# Altium schematic sheet 425AK01A_S05.SchDoc
size A3; DocumentNumber: 5; SheetNumber: 5; SheetTotal: 10; PageSetup: Record=PageOptions|CenterHorizontal=True|CenterVertical=True|PrintScale=1.01|XCorrection=1.00|YCorrection=1.00|PrintKind=1|BorderSize=5000000|LeftOffset=0|BottomOffset=0|Orientation=2|PaperLength=1000|PaperWidth=1000|Scale=100|PaperSource=15|PrintQuality=600|MediaType=1|DitherType=10|PaperKind=A3|PrintScaleMode=1; 00_Drawn: RJG; 00_Date: 8APR2022; 00_Checked: SR; 00_Approved: GN; 00_Line1: Clock Buffer Circuits, RSB A
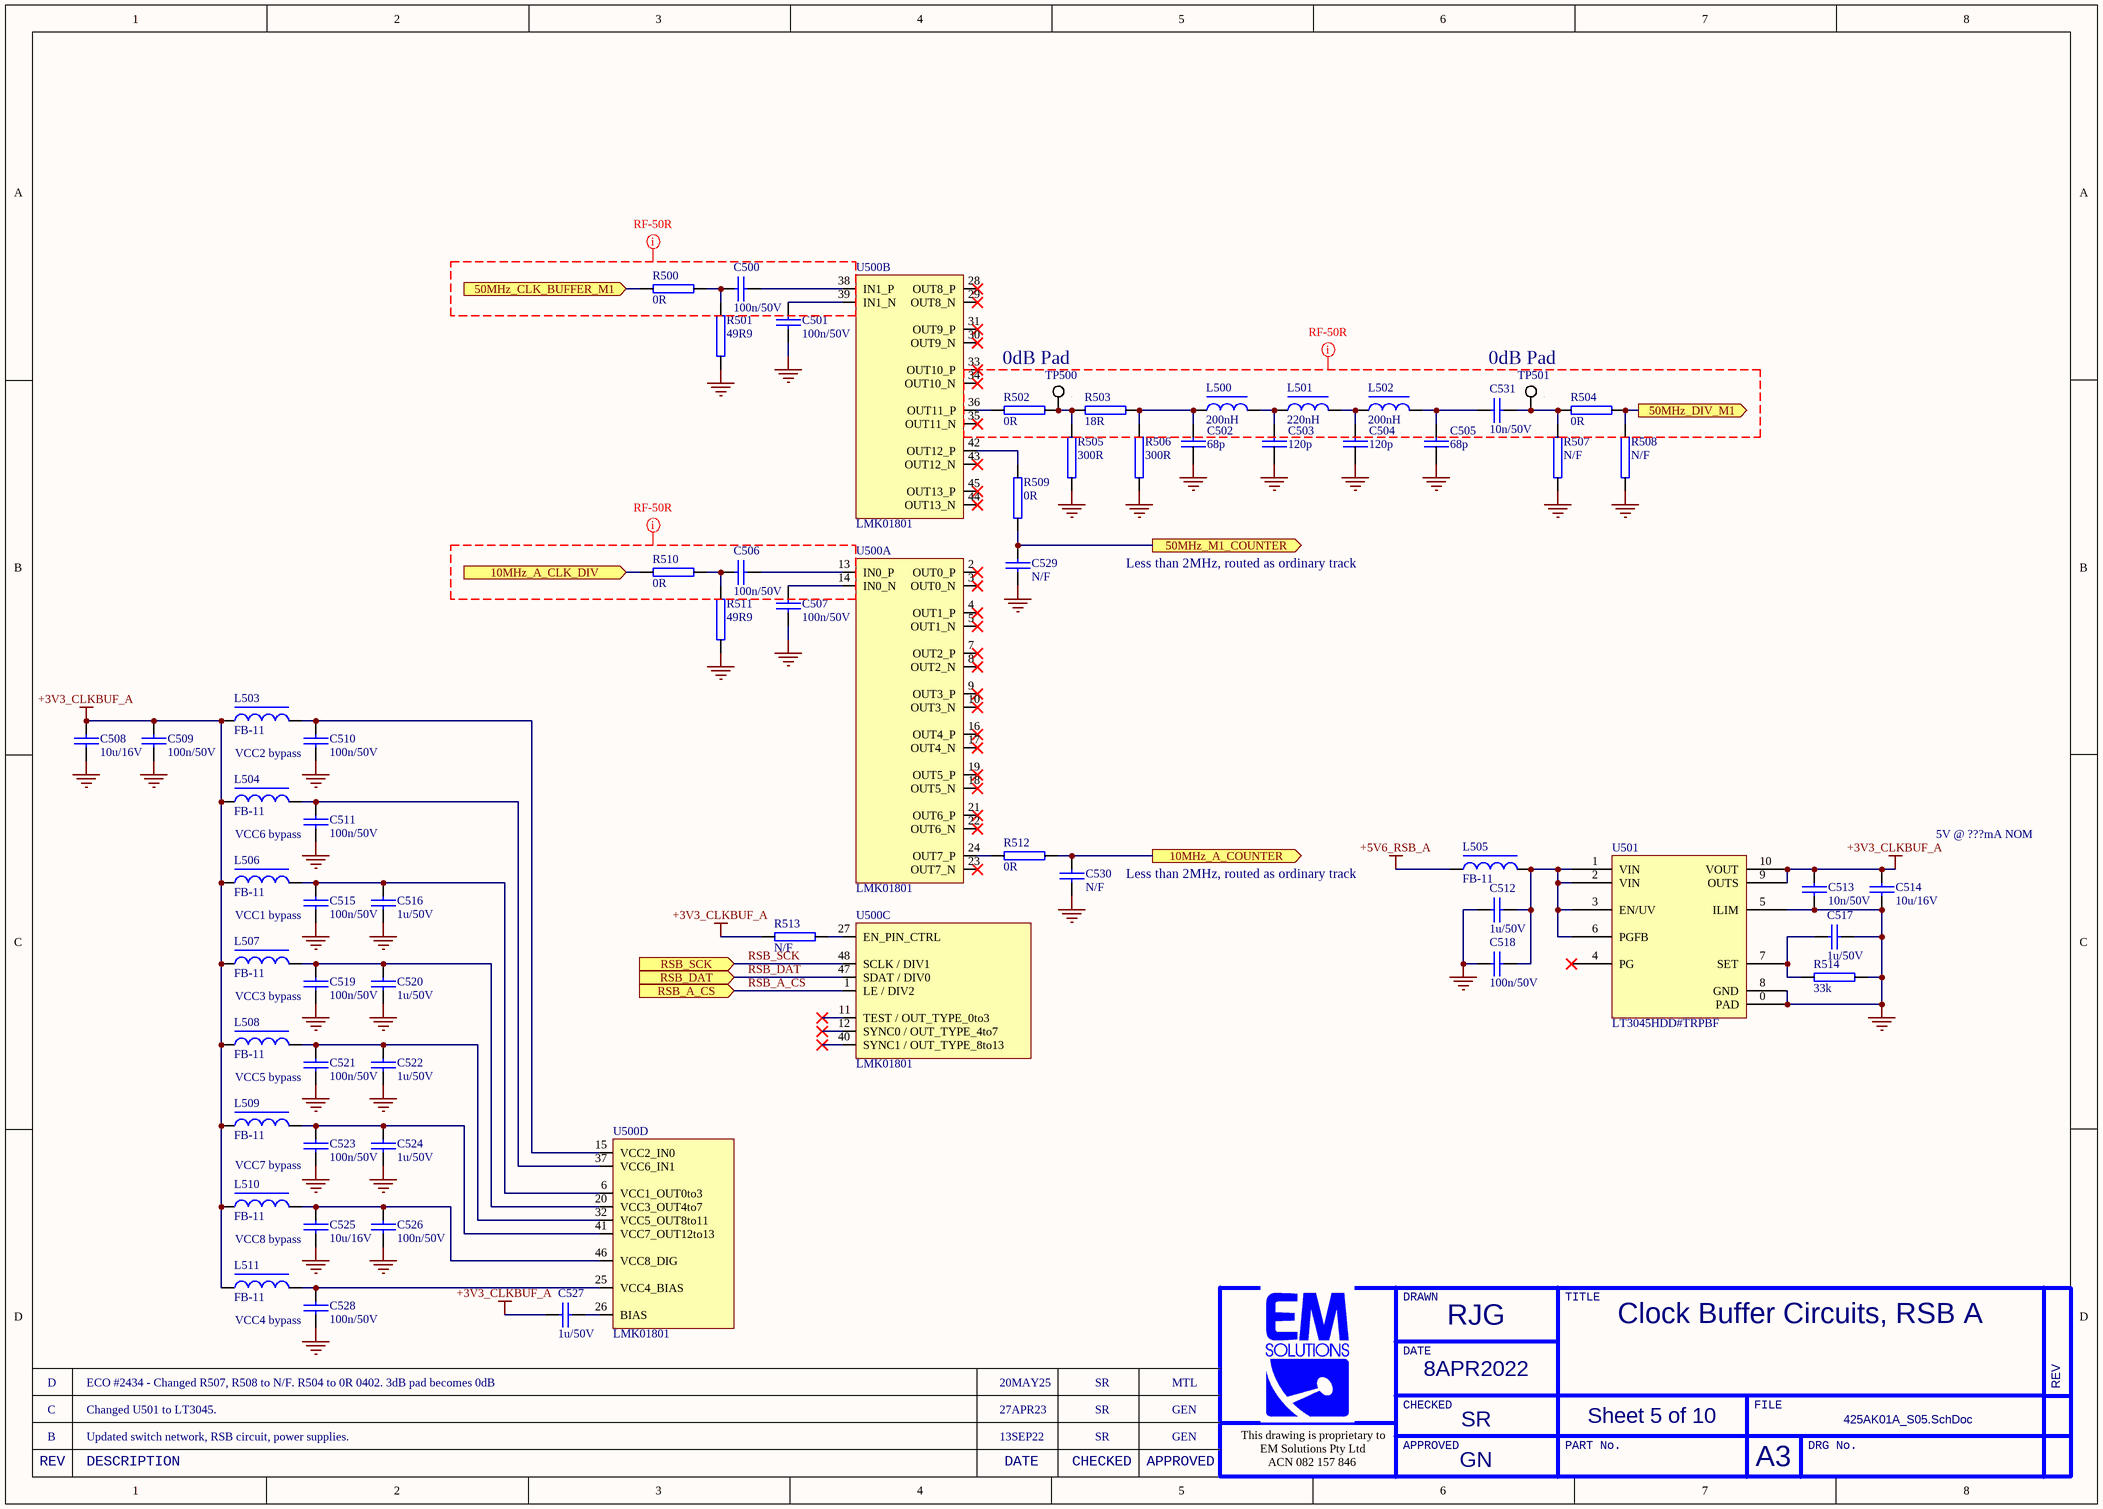
[diagram p0: 425AK01A_S05.SchDoc]

## Parts
C500  100n/50V  [0402C]
C501  100n/50V  [0402C]
C502  68p  [0402C]
C503  120p  [0402C]
C504  120p  [0402C]
C505  68p  [0402C]
C506  100n/50V  [0402C]
C507  100n/50V  [0402C]
C508  10u/16V  [0805C]
C509  100n/50V  [0402C]
C510  100n/50V  [0402C]
C511  100n/50V  [0402C]
C512  1u/50V  [0603C]
C513  10n/50V  [0402C]
C514  10u/16V  [0805C]
C515  100n/50V  [0402C]
C516  1u/50V  [0603C]
C517  1u/50V  [0603C]
C518  100n/50V  [0402C]
C519  100n/50V  [0402C]
C520  1u/50V  [0603C]
C521  100n/50V  [0402C]
C522  1u/50V  [0603C]
C523  100n/50V  [0402C]
C524  1u/50V  [0603C]
C525  10u/16V  [0805C]
C526  100n/50V  [0402C]
C527  1u/50V  [0603C]
C528  100n/50V  [0402C]
C529  N/F  [0402C]
C530  N/F  [0402C]
C531  10n/50V  [0402C]
L500  200nH  [0402L]
L501  220nH  [0402L]
L502  200nH  [0402L]
L503  FB-11  [0402L]
L504  FB-11  [0402L]
L505  FB-11  [0402L]
L506  FB-11  [0402L]
L507  FB-11  [0402L]
L508  FB-11  [0402L]
L509  FB-11  [0402L]
L510  FB-11  [0402L]
L511  FB-11  [0402L]
R500  0R  [0402]
R501  49R9  [0402]
R502  0R  [0402]
R503  18R  [0402]
R504  0R  [0402]
R505  300R  [0402]
R506  300R  [0402]
R507  N/F  [0402]
R508  N/F  [0402]
R509  0R  [0402]
R510  0R  [0402]
R511  49R9  [0402]
R512  0R  [0402]
R513  N/F  [0402]
R514  33k  [0402]
TP500  Pad  [Testpoint-0.5mm-SMT-withPaste]  (value not drawn)  (no BOM)
TP501  Pad  [Testpoint-0.5mm-SMT-withPaste]  (value not drawn)  (no BOM)
U500  LMK01801  [SQA48]  (parts A,B,C,D of 4)
U501  LT3045HDD#TRPBF  [DFN50P300X300X80_HS-11N]

## Ports
10MHz_A_CLK_DIV (in), 10MHz_A_COUNTER (out), 50MHz_CLK_BUFFER_M1 (in), 50MHz_DIV_M1 (out), 50MHz_M1_COUNTER (out), RSB_A_CS (in), RSB_DAT (in), RSB_SCK (in)

## Nets
+3V3_CLKBUF_A: C508.1 C509.1 C513.2 C514.1 C527.2 L503.1 L504.1 L506.1 L507.1 L508.1 L509.1 L510.1 L511.1 R513.1 U501.9(OUTS) U501.10(VOUT)
+5V6_RSB_A: L505.2
GND: C501.2 C502.1 C503.1 C504.1 C505.1 C507.2 C508.2 C509.2 C510.2 C511.1 C512.1 C513.1 C514.2 C515.2 C516.2 C517.2 C518.2 C519.2 C520.2 C521.2 C522.2 C523.2 C524.2 C525.2 C526.2 C528.1 C529.2 C530.2 R501.1 R505.2 R506.2 R507.2 R508.2 R511.1 R514.1 U500.0(EP) U501.0(PAD) U501.5(ILIM) U501.8(GND)
10MHz_A_CLK_DIV: R510.2 ; port 10MHz_A_CLK_DIV
10MHz_A_COUNTER: C530.1 R512.1 ; port 10MHz_A_COUNTER
50MHz_CLK_BUFFER_M1: R500.2 ; port 50MHz_CLK_BUFFER_M1
50MHz_DIV_M1: R504.1 R508.1 ; port 50MHz_DIV_M1
50MHz_M1_COUNTER: C529.1 R509.1 ; port 50MHz_M1_COUNTER
RSB_A_CS: U500.1(LE_/_DIV2) ; port RSB_A_CS
RSB_DAT: U500.47(SDAT_/_DIV0) ; port RSB_DAT
RSB_SCK: U500.48(SCLK_/_DIV1) ; port RSB_SCK
NetC500_1: C500.1 U500.38(IN1_P)
NetC500_2: C500.2 R500.1 R501.2
NetC501_1: C501.1 U500.39(IN1_N)
NetC502_2: C502.2 L500.1 R503.1 R506.1
NetC503_2: C503.2 L500.2 L501.1
NetC504_2: C504.2 L501.2 L502.1
NetC505_2: C505.2 C531.2 L502.2
NetC506_1: C506.1 U500.13(IN0_P)
NetC506_2: C506.2 R510.1 R511.2
NetC507_1: C507.1 U500.14(IN0_N)
NetC510_1: C510.1 L503.2 U500.15(VCC2_IN0)
NetC511_2: C511.2 L504.2 U500.37(VCC6_IN1)
NetC512_2: C512.2 C518.1 L505.1 U501.1(VIN) U501.2(VIN) U501.3(EN/UV) U501.6(PGFB)
NetC515_1: C515.1 C516.1 L506.2 U500.6(VCC1_OUT0to3)
NetC517_1: C517.1 R514.2 U501.7(SET)
NetC519_1: C519.1 C520.1 L507.2 U500.20(VCC3_OUT4to7)
NetC521_1: C521.1 C522.1 L508.2 U500.32(VCC5_OUT8to11)
NetC523_1: C523.1 C524.1 L509.2 U500.41(VCC7_OUT12to13)
NetC525_1: C525.1 C526.1 L510.2 U500.46(VCC8_DIG)
NetC527_1: C527.1 U500.26(BIAS)
NetC528_2: C528.2 L511.2 U500.25(VCC4_BIAS)
NetC531_1: C531.1 R504.2 R507.1 TP501.1
NetR502_1: R502.1 R503.2 R505.1 TP500.1
NetR502_2: R502.2 U500.36(OUT11_P)
NetR509_2: R509.2 U500.42(OUT12_P)
NetR512_2: R512.2 U500.24(OUT7_P)
NetR513_2: R513.2 U500.27(EN_PIN_CTRL)

Not connected (* = marked no-connect by the designer): U500 2(OUT0_P)* 3(OUT0_N)* 4(OUT1_P)* 5(OUT1_N)* 7(OUT2_P)* 8(OUT2_N)* 9(OUT3_P)* 10(OUT3_N)* 11(TEST_/_OUT_TYPE_0to3)* 12(SYNC0_/_OUT_TYPE_4to7)* 16(OUT4_P)* 17(OUT4_N)* 18(OUT5_N)* 19(OUT5_P)* 21(OUT6_P)* 22(OUT6_N)* 23(OUT7_N)* 28(OUT8_P)* 29(OUT8_N)* 30(OUT9_N)* 31(OUT9_P)* 33(OUT10_P)* 34(OUT10_N)* 35(OUT11_N)* 40(SYNC1_/_OUT_TYPE_8to13)* 43(OUT12_N)* 44(OUT13_N)* 45(OUT13_P)*; U501 4(PG)*

## Layout directives
net class RF-50R: (no net found under the mark)

## Notes on the sheet
- 0dB Pad
- Less than 2MHz, routed as ordinary track
- (near C510) VCC2 bypass
- (near C511) VCC6 bypass
- 5V @ ???mA NOM
- (near C515) VCC1 bypass
- (near C519) VCC3 bypass
- (near C521) VCC5 bypass
- (near C523) VCC7 bypass
- (near C525) VCC8 bypass
- (near C528) VCC4 bypass
- D
- ECO #2434 - Changed R507, R508 to N/F. R504 to 0R 0402. 3dB pad becomes 0dB
- 20MAY25
- SR
- MTL
- B
- C
- Updated switch network, RSB circuit, power supplies.
- Changed U501 to LT3045.
- 13SEP22
- 27APR23
- GEN
- DRAWN
- TITLE
- DATE
- REV
- This drawing is proprietary to
- EM Solutions Pty Ltd
- APPROVED
- CHECKED
- PART No.
- FILE
- A3
- DRG No.
- DESCRIPTION
- ACN 082 157 846

## Library data of the parts
C500 C501 C506 C507 C509-C511 C515 C518 C519 C521 C523 C526 C528 = 41-100N-13: Capacitor, 0402, 100n, X7R, 10% 50V, Ceramic; MANUFACTURER: MURATA; ID: 2441; MODELNAME: GRM155R71H104KE14J; Part Number: 41-100N-13; ItemID: 41-100N-13
C502 C505 = 41-068P-08: Capacitor, 0402, 68p; Part Number: 41-068P-08
C503 C504 = 41-120P-05: Capacitor, 0402, 120p NPO; Part Number: 41-120P-05
C508 C525 = 41-010U-08: Capacitor, 0805, 10u X5R 10% 16V Ceramic, NiSn; Part Number: 41-010U-08
C512 C517 = 41-01U0-06: Capacitor, 0603, 1u X7R 10% 50V Ceramic, NiSn; MANUFACTURER: TAIYOYUDEN; MODELNAME: UMK107AB7105KA; ID: 2287; Part Number: 41-01U0-06; ItemID: 41-01U0-06
C513 C531 = 41-010N-12: Capacitor, 0402, 10n X7R 10% 50V Ceramic, NiSn; MANUFACTURER: MURATA; ID: 2217; MODELNAME: GCM155R71H103KA55D; Part Number: 41-010N-12; ItemID: 41-010N-12
C514 = 41-010U-08: Capacitor, 0805, 10u X7R 10% 16V Ceramic, NiSn; MANUFACTURER: SAMSUNG; ID: 2232; MODELNAME: CL21B106KOQNNNE; Part Number: 41-010U-08; ItemID: 41-010U-08
C516 C520 C522 C524 C527 = 41-01U0-06: Capacitor, 0603, 1u X7R 10% 50V Ceramic, NiSn; MANUFACTURER: TAIYOYUDEN; ID: 2287; MODELNAME: UMK107AB7105KA; Part Number: 41-01U0-06; ItemID: 41-01U0-06
C529 C530 = 41-N/F-04: Capacitor, 0402, SOT, Not Fitted; ID: 2511; Part Number: 41-N/F-04; ItemID: 41-N/F-04
L500 L502 = 46-200N-04: Inductor, Chip, 200nH, 0402; Part Number: 46-200N-04
L501 = 46-220N-05: Inductor, Chip, 220nH, 0402; Part Number: 46-220N-05
L503 L504 L506-L511 = 46-B-11: Solid Inductor, 600ohm@100MHz, DCR=0.52, 0.3A, 0402 size; MANUFACTURER: TDK; ID: 3256; MODELNAME: MMZ1005S601C; Part Number: 46-B-11; ItemID: 46-B-11
L505 = 46-B-11: Solid Inductor, 600ohm@100MHz, DCR=0.52, 0.3A, 0402 size; MANUFACTURER: TDK; MODELNAME: MMZ1005S601C; ID: 3256; Part Number: 46-B-11; ItemID: 46-B-11
R500 R502 R509 R510 R512 = 44-000R-10: Resistor, 0402, 0R 1% 0.063W; MANUFACTURER: GENERIC; ID: 2538; Part Number: 44-000R-10; ItemID: 44-000R-10; MODELNAME: GENERIC
R501 R511 = 44-049R9-10: Resistor, 0402, 49R9 1% 0.063W; ID: 2787; MODELNAME: RC0402FR-0749R9L; Part Number: 44-049R9-10; ItemID: 44-049R9-10
R503 = 44-018R-10: Resistor, 0402, 18R 1% 0.063W; MANUFACTURER: GENERIC; ID: 2594; Part Number: 44-018R-10; ItemID: 44-018R-10; MODELNAME: GENERIC
R504 = 44-000R-10: Resistor, 0402, 0R 1% 0.063W 1A; ID: 2538; MODELNAME: CRG0402ZR; Part Number: 44-000R-10; ItemID: 44-000R-10
R505 R506 = 44-300R-10: Resistor, 0402, 300R 1% 0.063W; MANUFACTURER: GENERIC; ID: 3023; Part Number: 44-300R-10; ItemID: 44-300R-10; MODELNAME: GENERIC
R507 R508 R513 = 44-N/F-10: Resistor, 0402, SOT, Not Fitted; ID: 3111; Part Number: 44-N/F-10; ItemID: 44-N/F-10
R514 = 44-033K-10: Resistor, 0402, 33k 1% 0.063W; MANUFACTURER: GENERIC; ID: 2720; Part Number: 44-033K-10; ItemID: 44-033K-10; MODELNAME: GENERIC
TP500 TP501 = Pad: Pad that can be a test point or a hot via
U500 = LMK01801: Dual Clock Divider Buffer; Part Number: 53-01801-01
U501 = 52-3045-01: Volt Regulator, Vin=1.8-20V, 500mA, LDO, Low Noise, 10-DFN (3x3), -40to+150C; MANUFACTURER: ANLG DEV; ID: 3362; Part Number: 52-3045-01; MODELNAME: LT3045HDD#TRPBF; ItemID: 52-3045-01